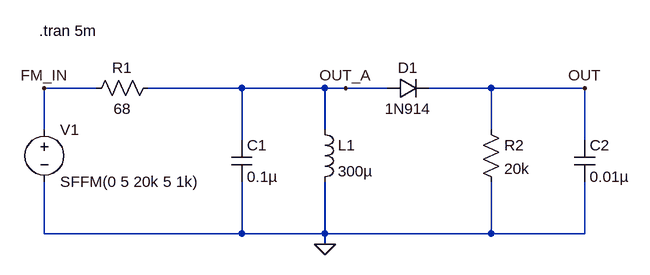
[diagram p0: schematic slope_detector-ltspice.asc]
slope_detector-ltspice.asc, the LTspice schematic file:
Version 4
SHEET 1 880 680
WIRE -96 128 -176 128
WIRE 128 128 -16 128
WIRE 256 128 128 128
WIRE 288 128 256 128
WIRE 352 128 288 128
WIRE 512 128 416 128
WIRE 656 128 512 128
WIRE -176 192 -176 128
WIRE 256 192 256 128
WIRE 512 192 512 128
WIRE 128 208 128 128
WIRE 656 208 656 128
WIRE -176 352 -176 272
WIRE 128 352 128 272
WIRE 128 352 -176 352
WIRE 256 352 256 272
WIRE 256 352 128 352
WIRE 512 352 512 272
WIRE 512 352 256 352
WIRE 656 352 656 272
WIRE 656 352 512 352
WIRE 256 368 256 352
FLAG -176 128 FM_IN
FLAG 288 128 OUT_A
FLAG 256 368 0
FLAG 656 128 OUT
SYMBOL voltage -176 176 R0
SYMATTR InstName V1
SYMATTR Value SFFM(0 5 20k 5 1k)
SYMBOL res 0 112 R90
WINDOW 0 0 56 VBottom 2
WINDOW 3 32 56 VTop 2
SYMATTR InstName R1
SYMATTR Value 68
SYMBOL cap 112 208 R0
SYMATTR InstName C1
SYMATTR Value 0.1µ
SYMBOL ind 240 176 R0
SYMATTR InstName L1
SYMATTR Value 300µ
SYMBOL diode 352 144 R270
WINDOW 0 32 32 VTop 2
WINDOW 3 0 32 VBottom 2
SYMATTR InstName D1
SYMATTR Value 1N914
SYMBOL res 496 176 R0
SYMATTR InstName R2
SYMATTR Value 20k
SYMBOL cap 640 208 R0
SYMATTR InstName C2
SYMATTR Value 0.01µ
TEXT -184 40 Left 2 !.tran 5m

The netlist it stands for:
* slope_detector-ltspice.asc
V1 FM_IN 0 SFFM(0 5 20k 5 1k)
R1 OUT_A FM_IN 68
C1 OUT_A 0 0.1µ
L1 OUT_A 0 300µ
D1 OUT_A OUT 1N914
R2 OUT 0 20k
C2 OUT 0 0.01µ
.model D D
.lib standard.dio
.tran 5m
.backanno
.end